# Altium project MCU103A.PrjPcb (part 4 of 4)

## Sheet MCU103A_Hardware.SchDoc
size 431 x 279 mm; Date: Not shown in title block; ApprovedBy: Not shown in title block; CheckedBy: Not shown in title block; Author: Not shown in title block; CompanyName: Not shown in title block; Engineer: Not shown in title block; Organization: Not shown in title block; Address1: Not shown in title block; Address2: Not shown in title block; Address3: Not shown in title block; Address4: Not shown in title block; DocumentNumber: 8; Revision: Use project parameter SCH_Rev; SheetNumber: 8; SheetTotal: 8; PageSetup: Record=PageOptions|CenterHorizontal=True|CenterVertical=True|PrintScale=1.00|XCorrection=1.00|YCorrection=1.00|PrintKind=0|BorderSize=5000000|LeftOffset=0|BottomOffset=0|Orientation=2|PaperLength=1000|PaperWidth=1000|Scale=100|PaperSource=15|PrintQuality=600|MediaType=1|DitherType=10|PaperKind=Letter|PrintScaleMode=1; CurrentTime: Not shown in title block; CurrentDate: Not shown in title block; Time: Not shown in title block; DocumentFullPathAndName: Not shown in title block; DocumentName: Not shown in title block; ModifiedDate: Not shown in title block; ImagePath: Not shown in title block
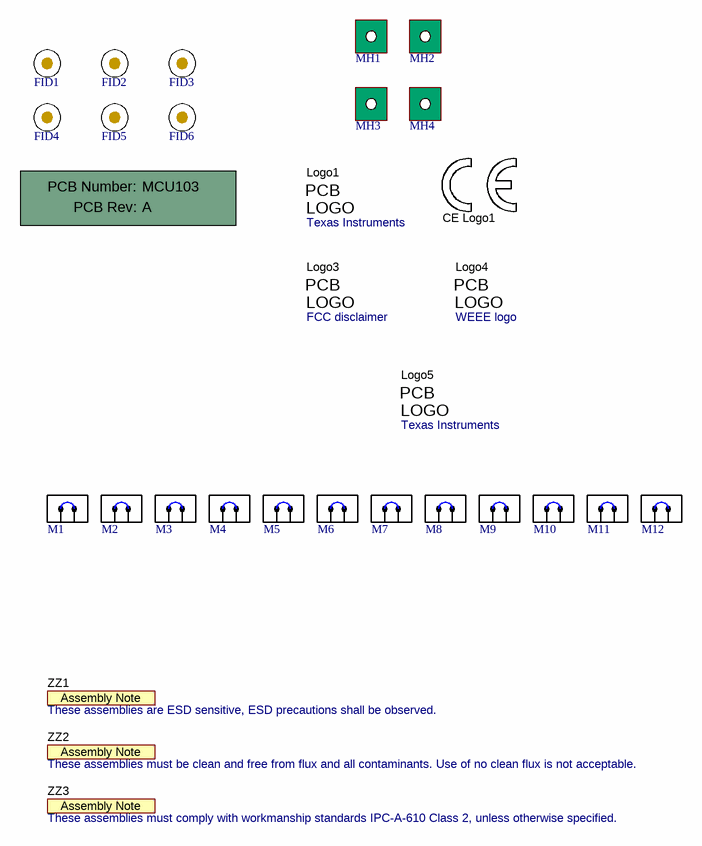
[diagram p7: MCU103A_Hardware.SchDoc]

### Parts
!PCB1  Printed Circuit Board  (value not drawn)  (mechanical)
CE_Logo1  CE Mark  [CE_Mark_5mm]  (value not drawn)  (no BOM)
FID1  Fiducial  [Fiducial10-20]  (value not drawn)
FID2  Fiducial  [Fiducial10-20]  (value not drawn)
FID3  Fiducial  [Fiducial10-20]  (value not drawn)
FID4  Fiducial  [Fiducial10-20]  (value not drawn)
FID5  Fiducial  [Fiducial10-20]  (value not drawn)
FID6  Fiducial  [Fiducial10-20]  (value not drawn)
Logo1  Texas Instruments  [TI_Stacked_Overlay_Medium]  (no BOM)
Logo3  FCC disclaimer  [FCC_disclaimer]  (no BOM)
Logo4  WEEE logo  [WEEE_Minimum]  (no BOM)
Logo5  Texas Instruments  [TI_Symbol_Overlay_Small]  (no BOM)
M1  60900213421  [Wurth_60900213421]  (value not drawn)
M2  60900213421  [Wurth_60900213421]  (value not drawn)
M3  60900213421  [Wurth_60900213421]  (value not drawn)
M4  60900213421  [Wurth_60900213421]  (value not drawn)
M5  60900213421  [Wurth_60900213421]  (value not drawn)
M6  60900213421  [Wurth_60900213421]  (value not drawn)
M7  60900213421  [Wurth_60900213421]  (value not drawn)
M8  60900213421  [Wurth_60900213421]  (value not drawn)
M9  60900213421  [Wurth_60900213421]  (value not drawn)
M10  60900213421  [Wurth_60900213421]  (value not drawn)
M11  60900213421  [Wurth_60900213421]  (value not drawn)
M12  60900213421  [Wurth_60900213421]  (value not drawn)
MH1  MTG_NoPads  [NPTH125mil]  (value not drawn)  (no BOM)
MH2  MTG_NoPads  [NPTH125mil]  (value not drawn)  (no BOM)
MH3  MTG_NoPads  [NPTH125mil]  (value not drawn)  (no BOM)
MH4  MTG_NoPads  [NPTH125mil]  (value not drawn)  (no BOM)
ZZ1  These assemblies are ESD sensitive, ESD precautions shall be observed.  [AssemblyNote]  (no BOM)
ZZ2  These assemblies must be clean and free from flux and all contaminants. Use of no clean flux is not acceptable.  [AssemblyNote]  (no BOM)
ZZ3  These assemblies must comply with workmanship standards IPC-A-610 Class 2, unless otherwise specified.  [AssemblyNote]  (no BOM)

### Notes on the sheet
- Drawn By:
- SVN Rev:
- Number:
- TID #:
- Orderable:
- Rev:
- Sheet Title:
- File:
- Project Title:
- Designed for:
- Assembly Variant:
- Mod. Date:
- Sheet:
- Size:
- of
- B
- http://www.ti.com
- Texas Instruments and/or its licensors do not warrant the accuracy or completeness of this specification or any information contained therein. Texas Instruments and/or its licensors do not warrant that this design will meet the specifications, will be suitable for your application or fit for any particular purpose, or will operate in an implementation. Texas Instruments and/or its licensors do not warrant that the design is production worthy. You should completely validate and test your design implementation to confirm the system functionality for your application.
- Engineer:
- Contact:
- © Texas Instruments
- (in symbol CMP-0003618-2) PCB Number:; PCB Rev:
- (in symbol CMP-0074769-1) PCB; LOGO
- (in symbol CMP-0074838-1) PCB; LOGO
- (in symbol CMP-0074847-1) PCB; LOGO

### Library data of the parts
!PCB1 = CMP-0003618-2: Manufacturer: Any; PartNumber: MCU103; CompType: PCB; RoHS: O; MountType: N/A; Publisher: Texas Instruments; LatestRevisionDate: 2017-03-09; Key: PCB
CE_Logo1 = CMP-0074844-1: SymbolCreator: a0412235; Published: 2009-03-03; Publisher: Texas Instruments; LatestRevisionDate: 2017-07-06; Lib Reference: CE Mark; PartNumber: CE Mark; Library Reference: CE Mark
FID1-FID6 = CMP-0077181-1: Fiducial mark.  There is nothing to buy or mount.; CompType: Fiducial; Manufacturer: N/A; MountType: N/A; PackageReference: N/A; PartNumber: N/A; ClassName: FiducialMark; Library Reference: Fiducial
Logo1 Logo5 = CMP-0074838-1: Texas Instrument Corporate Signature; SymbolCreator: a0412235; Lib Reference: TI_Logo; SymbolVersion: 2011-08-22; Published: 2009-03-03; Publisher: Texas Instruments; ClassName: Logo; LatestRevisionDate: 2017-07-06; PartNumber: Texas Instruments; Library Reference: Logo
Logo3 = CMP-0074847-1: FCC_disclaimer; Published: 2009-03-03; Publisher: Texas Instruments; LatestRevisionDate: 2017-07-06; Lib Reference: FCC_disclaimer; PartNumber: FCC disclaimer; Library Reference: Logo
Logo4 = CMP-0074769-1: Library Reference: WEEE logo; Lib Reference: WEEE logo; PartNumber: WEEE logo
M1-M12 = CMP-0003761-2: Shunt, 2.54mm, Gold, Black; Manufacturer: Wurth Elektronik; ComponentLink1URL: http://katalog.we-online.de/em/datasheet/60900213421.pdf; Supplier Part Number 2: 16T0609; Supplier 3: Mouser; Supplier 1: Digi-Key; CompType: Shunt; PackageReference: Shunt, 2.54mm, Black; RoHS: Y; Supplier Part Number 1: 732-2678-ND; Supplier Part Number 3: 710-60900213421; Supplier 2: Newark; MountType: N/A; PartNumber: 60900213421; ComponentLink1Description: Datasheet Link; ClassName: Shunt
MH1-MH4 = CMP-0078424-2: PCB Mounting Hole, No Pad; Manufacturer: Any; Key: Mounting Hole (non-standard) No Pad; CompType: Mounting Hole; PartNumber: N/A; PackageReference: Mounting Hole; MountType: N/A
ZZ1 = CMP-0077236-1: CompType: AssemblyNote; ClassName: AssemblyNote; Publisher: Texas Instruments; LatestRevisionDate: 2017-08-10; Key: AssemblyNote
ZZ2 = CMP-0077237-1: CompType: AssemblyNote; ClassName: AssemblyNote; Publisher: Texas Instruments; LatestRevisionDate: 2017-08-10; Key: AssemblyNote
ZZ3 = CMP-0077238-1: CompType: AssemblyNote; ClassName: AssemblyNote; Publisher: Texas Instruments; LatestRevisionDate: 2017-08-10; Key: AssemblyNote

## Nets that join several sheets
+3V3_MCU: MCU103A_Connectors (5 pins), MCU103A_AltRouting_Misc (24 pins), MCU103A_F280039C_Device (7 pins), MCU103A_USB_and_Power (11 pins)
+3V3_XDS110: MCU103A_USB_and_Power (12 pins), MCU103A_XDS110_MCU (34 pins)
+5V0_MCU: MCU103A_Connectors (10 pins), MCU103A_AltRouting_Misc (C65.2 C67.1 U13.23 U13.24), MCU103A_USB_and_Power (5 pins)
+5V0_XDS110: MCU103A_USB_and_Power (5 pins), MCU103A_XDS110_MCU (R62.1)
GND: MCU103A_Connectors (21 pins), MCU103A_AltRouting_Misc (37 pins), MCU103A_F280039C_Device (48 pins), MCU103A_F2800137_Device (6 pins), MCU103A_USB_and_Power (27 pins), MCU103A_XDS110_MCU (37 pins)
VDD: MCU103A_F280039C_Device (9 pins), MCU103A_F2800137_Device (U18.4 U18.44 U18.59), MCU103A_USB_and_Power (TP1.1)
VDDA: MCU103A_F280039C_Device (C14.2 C15.1 L2.2 U1.34), MCU103A_F2800137_Device (U18.22), MCU103A_USB_and_Power (TP3.1)
VDDIO: MCU103A_F280039C_Device (10 pins), MCU103A_F2800137_Device (U18.43 U18.60), MCU103A_USB_and_Power (TP2.1)
ADCINA0/B15/C15: MCU103A_Connectors (J5/J7.70), MCU103A_F280039C_Device (R12.1)
ADCINA1/B7: MCU103A_Connectors (J1/J3.30), MCU103A_F280039C_Device (R13.1)
ADCINA2/B6/C9: MCU103A_Connectors (J1/J3.24), MCU103A_F280039C_Device (R14.1)
ADCINA3/B9/C7: MCU103A_Connectors (J1/J3.25), MCU103A_F280039C_Device (R15.1)
ADCINA4/B8: MCU103A_Connectors (J5/J7.66), MCU103A_F280039C_Device (R16.1)
ADCINA5: MCU103A_Connectors (J5/J7.65), MCU103A_F280039C_Device (R17.1)
ADCINA6: MCU103A_Connectors (J1/J3.23), MCU103A_F280039C_Device (R18.1)
ADCINA7/C3: MCU103A_Connectors (J1/J3.29), MCU103A_F280039C_Device (R19.1)
ADCINA9: MCU103A_Connectors (J5/J7.46), MCU103A_F280039C_Device (R20.1)
ADCINA10/B1/C10: MCU103A_Connectors (J5/J7.64), MCU103A_F280039C_Device (R21.1)
ADCINA11/B10/C0: MCU103A_Connectors (J1/J3.27), MCU103A_F280039C_Device (R22.1)
ADCINA12/C5: MCU103A_Connectors (J5/J7.69), MCU103A_F280039C_Device (R23.1)
ADCINA14/B14/C4: MCU103A_Connectors (J1/J3.26), MCU103A_F280039C_Device (R24.1)
ADCINB2/C6: MCU103A_Connectors (J1/J3.2), MCU103A_F280039C_Device (R25.1)
ADCINB3: MCU103A_Connectors (J1/J3.6), MCU103A_F280039C_Device (R26.1)
ADCINB4/C8: MCU103A_Connectors (J5/J7.67), MCU103A_F280039C_Device (R27.1)
ADCINB5: MCU103A_Connectors (J5/J7.68), MCU103A_F280039C_Device (R84.1)
ADCINB11: MCU103A_Connectors (J5/J7.63), MCU103A_F280039C_Device (R85.1)
ADCINB12/C2: MCU103A_Connectors (J1/J3.28), MCU103A_F280039C_Device (R86.1)
ADCINC1: MCU103A_Connectors (J5/J7.42), MCU103A_F280039C_Device (R87.1)
EQEP1A: MCU103A_Connectors (C68.1 J12.1 R72.1), MCU103A_AltRouting_Misc (U13.21)
EQEP1B: MCU103A_Connectors (C69.1 J12.2 R73.1), MCU103A_AltRouting_Misc (U13.20)
EQEP1I: MCU103A_Connectors (C70.1 J12.3 R74.1), MCU103A_AltRouting_Misc (U13.19)
EQEP2A: MCU103A_Connectors (C71.1 J13.1 R75.1), MCU103A_AltRouting_Misc (U13.18)
EQEP2B: MCU103A_Connectors (C72.1 J13.2 R76.1), MCU103A_AltRouting_Misc (U13.17)
EQEP2I: MCU103A_Connectors (C73.1 J13.3 R77.1), MCU103A_AltRouting_Misc (U13.16)
GPIO0: MCU103A_Connectors (R8.1), MCU103A_F280039C_Device (U1.79), MCU103A_F2800137_Device (U18.52)
GPIO1: MCU103A_Connectors (R9.1), MCU103A_F280039C_Device (U1.78), MCU103A_F2800137_Device (U18.51)
GPIO2: MCU103A_Connectors (J4/J2.38), MCU103A_F280039C_Device (U1.77), MCU103A_F2800137_Device (U18.50)
GPIO3: MCU103A_Connectors (J4/J2.37), MCU103A_F280039C_Device (U1.76), MCU103A_F2800137_Device (U18.49)
GPIO4: MCU103A_AltRouting_Misc (S4.2), MCU103A_F280039C_Device (U1.75), MCU103A_F2800137_Device (U18.48)
GPIO4_BP: MCU103A_Connectors (J5/J7.48), MCU103A_AltRouting_Misc (S4.3)
GPIO4_CANTX: MCU103A_Connectors (TP7.1 U15.1), MCU103A_AltRouting_Misc (S4.1)
GPIO5: MCU103A_AltRouting_Misc (S4.5), MCU103A_F280039C_Device (U1.89), MCU103A_F2800137_Device (U18.61)
GPIO5_BP: MCU103A_Connectors (J4/J2.19), MCU103A_AltRouting_Misc (S4.6)
GPIO5_CANRX: MCU103A_Connectors (TP8.1 U15.4), MCU103A_AltRouting_Misc (S4.4)
GPIO6: MCU103A_Connectors (J8/J6.78), MCU103A_F280039C_Device (U1.97), MCU103A_F2800137_Device (U18.64)
GPIO7: MCU103A_Connectors (J8/J6.77), MCU103A_F280039C_Device (U1.84), MCU103A_F2800137_Device (U18.57)
GPIO8: MCU103A_Connectors (J4/J2.15), MCU103A_F280039C_Device (U1.74), MCU103A_F2800137_Device (U18.47)
GPIO9: MCU103A_Connectors (J1/J3.7), MCU103A_F280039C_Device (U1.90), MCU103A_F2800137_Device (U18.62)
GPIO10: MCU103A_Connectors (J4/J2.36), MCU103A_F280039C_Device (U1.93), MCU103A_F2800137_Device (U18.63)
GPIO11: MCU103A_Connectors (J4/J2.35), MCU103A_F280039C_Device (U1.52), MCU103A_F2800137_Device (U18.31)
GPIO12: MCU103A_Connectors (R49.1), MCU103A_F280039C_Device (U1.51), MCU103A_F2800137_Device (U18.30)
GPIO13: MCU103A_Connectors (R50.1), MCU103A_F280039C_Device (U1.50), MCU103A_F2800137_Device (U18.29)
GPIO14: MCU103A_AltRouting_Misc (U11.14), MCU103A_F280039C_Device (U1.96)
GPIO14_BP: MCU103A_Connectors (J4/J2.32), MCU103A_AltRouting_Misc (U11.13)
GPIO15: MCU103A_AltRouting_Misc (U8.6), MCU103A_F280039C_Device (U1.95)
GPIO15_BP: MCU103A_Connectors (J5/J7.43), MCU103A_AltRouting_Misc (U8.7)
GPIO16: MCU103A_Connectors (J8/J6.76), MCU103A_F280039C_Device (U1.54), MCU103A_F2800137_Device (U18.33)
GPIO17: MCU103A_Connectors (J4/J2.14), MCU103A_F280039C_Device (U1.55), MCU103A_F2800137_Device (U18.34)
GPIO18_BP: MCU103A_Connectors (J5/J7.49), MCU103A_AltRouting_Misc (R36.1)
GPIO18_X2: MCU103A_AltRouting_Misc (R32.1 R36.2), MCU103A_F280039C_Device (U1.68), MCU103A_F2800137_Device (U18.41)
GPIO19_BP: MCU103A_Connectors (J5/J7.50), MCU103A_AltRouting_Misc (R37.1)
GPIO19_X1: MCU103A_AltRouting_Misc (R33.1 R37.2), MCU103A_F280039C_Device (U1.69), MCU103A_F2800137_Device (U18.42)
GPIO20: MCU103A_Connectors (J8/J6.53), MCU103A_AltRouting_Misc (R34.1), MCU103A_F280039C_Device (U1.48), MCU103A_F2800137_Device (U18.27)
GPIO21: MCU103A_Connectors (J8/J6.74), MCU103A_F280039C_Device (U1.49), MCU103A_F2800137_Device (U18.28)
GPIO22: MCU103A_Connectors (J4/J2.12), MCU103A_AltRouting_Misc (R35.1), MCU103A_F280039C_Device (U1.83), MCU103A_F2800137_Device (U18.56)
GPIO23: MCU103A_Connectors (J4/J2.11), MCU103A_F280039C_Device (U1.81), MCU103A_F2800137_Device (U18.54)
GPIO24: MCU103A_Connectors (J1/J3.8), MCU103A_AltRouting_Misc (R38.1), MCU103A_F280039C_Device (U1.56), MCU103A_F2800137_Device (U18.35)
GPIO25: MCU103A_Connectors (J8/J6.51), MCU103A_F280039C_Device (U1.57)
GPIO26: MCU103A_Connectors (J8/J6.52), MCU103A_F280039C_Device (U1.58)
GPIO27: MCU103A_Connectors (J8/J6.59), MCU103A_F280039C_Device (U1.59)
GPIO28: MCU103A_AltRouting_Misc (U6.10), MCU103A_F280039C_Device (U1.1), MCU103A_F2800137_Device (U18.2)
GPIO28_BP: MCU103A_Connectors (J1/J3.3), MCU103A_AltRouting_Misc (U6.2)
GPIO29: MCU103A_AltRouting_Misc (U6.6), MCU103A_F280039C_Device (U1.100), MCU103A_F2800137_Device (U18.1)
GPIO29_BP: MCU103A_Connectors (J1/J3.4 J1/J3.5), MCU103A_AltRouting_Misc (U6.4)
GPIO30: MCU103A_Connectors (J4/J2.31), MCU103A_F280039C_Device (U1.98)
GPIO31: MCU103A_Connectors (J8/J6.73), MCU103A_F280039C_Device (U1.99)
GPIO32: MCU103A_Connectors (J4/J2.18), MCU103A_AltRouting_Misc (R39.2), MCU103A_F280039C_Device (U1.64), MCU103A_F2800137_Device (U18.40)
GPIO33: MCU103A_Connectors (J4/J2.34), MCU103A_F280039C_Device (U1.53), MCU103A_F2800137_Device (U18.32)
GPIO34: MCU103A_Connectors (J1/J3.10), MCU103A_F280039C_Device (U1.94)
GPIO35: MCU103A_Connectors (J8/J6.75), MCU103A_F280039C_Device (R44.1 U1.63), MCU103A_F2800137_Device (U18.39)
GPIO37: MCU103A_Connectors (J4/J2.13), MCU103A_F280039C_Device (R45.1 U1.61), MCU103A_F2800137_Device (U18.37)
GPIO40: MCU103A_AltRouting_Misc (U14.14), MCU103A_F280039C_Device (U1.80), MCU103A_F2800137_Device (U18.53)
GPIO40_BP: MCU103A_Connectors (J8/J6.71), MCU103A_AltRouting_Misc (U14.13)
GPIO41: MCU103A_AltRouting_Misc (U14.15), MCU103A_F280039C_Device (U1.82), MCU103A_F2800137_Device (U18.55)
GPIO41_BP: MCU103A_Connectors (J8/J6.72), MCU103A_AltRouting_Misc (U14.1)
GPIO44_FSITXCLK: MCU103A_Connectors (J11.2), MCU103A_F280039C_Device (U1.85)
GPIO47: MCU103A_Connectors (J8/J6.58), MCU103A_F280039C_Device (U1.6)
GPIO48: MCU103A_Connectors (J4/J2.33), MCU103A_F280039C_Device (U1.7)
GPIO49_FSITXD0: MCU103A_Connectors (J11.6), MCU103A_F280039C_Device (U1.8)
GPIO50_FSITXD1: MCU103A_Connectors (J11.8), MCU103A_F280039C_Device (U1.9)
GPIO51: MCU103A_Connectors (J1/J3.9), MCU103A_F280039C_Device (U1.10)
GPIO52_FSIRXD0: MCU103A_Connectors (J11.5), MCU103A_F280039C_Device (U1.11)
GPIO53_FSIRXD1: MCU103A_Connectors (J11.7), MCU103A_F280039C_Device (U1.12)
GPIO54_FSIRXCLK: MCU103A_Connectors (J11.1), MCU103A_F280039C_Device (U1.13)
GPIO55: MCU103A_AltRouting_Misc (U11.15), MCU103A_F280039C_Device (U1.43)
GPIO56: MCU103A_AltRouting_Misc (U8.10), MCU103A_F280039C_Device (U1.65)
GPIO56_BP: MCU103A_Connectors (J5/J7.44 J5/J7.45), MCU103A_AltRouting_Misc (U8.9)
GPIO57: MCU103A_AltRouting_Misc (U11.4), MCU103A_F280039C_Device (U1.66)
GPIO57_BP: MCU103A_Connectors (J8/J6.57), MCU103A_AltRouting_Misc (U11.3)
GPIO58: MCU103A_Connectors (J5/J7.47), MCU103A_F280039C_Device (U1.67)
GPIO59: MCU103A_AltRouting_Misc (U14.4), MCU103A_F280039C_Device (U1.92), MCU103A_F2800137_Device (U18.46)
GPIO59_BP: MCU103A_Connectors (J4/J2.17), MCU103A_AltRouting_Misc (U14.3)
GPIO60: MCU103A_Connectors (J8/J6.55), MCU103A_F280039C_Device (U1.44)
GPIO61: MCU103A_Connectors (J8/J6.54), MCU103A_F280039C_Device (U1.91)
MCU_A2/B6/C9: MCU103A_F280039C_Device (C26.1 R14.2 U1.17), MCU103A_F2800137_Device (U18.8)
MCU_A3/B9/C7: MCU103A_F280039C_Device (C34.1 R15.2 U1.18), MCU103A_F2800137_Device (U18.9)
MCU_A4/B8: MCU103A_F280039C_Device (C27.1 R16.2 U1.36), MCU103A_F2800137_Device (U18.23)
MCU_A5: MCU103A_F280039C_Device (C35.1 R17.2 U1.35), MCU103A_F2800137_Device (U18.20)
MCU_A6: MCU103A_F280039C_Device (C28.1 R18.2 U1.14), MCU103A_F2800137_Device (U18.6)
MCU_A7/C3: MCU103A_F280039C_Device (C36.1 R19.2 U1.31), MCU103A_F2800137_Device (U18.18)
MCU_A10/B1/C10: MCU103A_F280039C_Device (C37.1 R21.2 U1.40), MCU103A_F2800137_Device (U18.19)
MCU_A11/B10/C0: MCU103A_F280039C_Device (C30.1 R22.2 U1.20), MCU103A_F2800137_Device (U18.11)
MCU_A12/C5: MCU103A_F280039C_Device (C38.1 R23.2 U1.28), MCU103A_F2800137_Device (U18.15)
MCU_A14/B14/C4: MCU103A_F280039C_Device (C31.1 R24.2 U1.19), MCU103A_F2800137_Device (U18.10)
MCU_B2/C6: MCU103A_F280039C_Device (C39.1 R25.2 U1.15), MCU103A_F2800137_Device (U18.7)
MCU_B4/C8: MCU103A_F280039C_Device (C40.1 R27.2 U1.39), MCU103A_F2800137_Device (U18.24)
MCU_B5: MCU103A_F280039C_Device (C75.1 R84.2 U1.32), MCU103A_F2800137_Device (U18.25)
MCU_B11: MCU103A_F280039C_Device (C77.1 R85.2 U1.30), MCU103A_F2800137_Device (U18.13)
MCU_B12/C2: MCU103A_F280039C_Device (C76.1 R86.2 U1.21), MCU103A_F2800137_Device (U18.12)
MCU_C1: MCU103A_F280039C_Device (C78.1 R87.2 U1.29), MCU103A_F2800137_Device (U18.14)
MCU_RXD: MCU103A_AltRouting_Misc (U9.6), MCU103A_XDS110_MCU (J101.2)
MCU_TCK: MCU103A_F280039C_Device (U1.60), MCU103A_F2800137_Device (U18.36), MCU103A_XDS110_MCU (J101.8)
MCU_TDI: MCU103A_F280039C_Device (R44.2), MCU103A_XDS110_MCU (J101.12)
MCU_TDO: MCU103A_F280039C_Device (R45.2), MCU103A_XDS110_MCU (J101.10)
MCU_TMS: MCU103A_F280039C_Device (R10.1 U1.62), MCU103A_F2800137_Device (U18.38), MCU103A_XDS110_MCU (J101.6)
MCU_TXD: MCU103A_AltRouting_Misc (U9.10), MCU103A_XDS110_MCU (J101.4)
VREFHI: MCU103A_F280039C_Device (C24.1 J15.1 U1.24 U1.25), MCU103A_F2800137_Device (U18.16)
XDS_DM: MCU103A_USB_and_Power (R1.2), MCU103A_XDS110_MCU (U2.93)
XDS_DP: MCU103A_USB_and_Power (R2.2), MCU103A_XDS110_MCU (U2.94)
XRSn: MCU103A_Connectors (J4/J2.16 J8/J6.56), MCU103A_F280039C_Device (C17.2 R11.1 S1.4 U1.2), MCU103A_F2800137_Device (U18.3), MCU103A_USB_and_Power (C7.1 R4.1 R5.2)

## Assembly variants
001: not fitted C25 C26 C27 C28 C29 C30 C31 C32 C33 C34 C35 C36 C37 C38 C39 C40 C75 C76 C77 C78 C81 C82 C83 C84 C101 FID1 FID2 FID3 FID4 FID5 FID6 R36 R37 R44 R45 R47 R48 R67 R82 R100 U18